# EasyEDA schematic SCH_CanSat2024_v5.1.json
TITLE: CanSat (2024) Schematic; REV: 5; Date: 2024-05-11; Sheet: 1/1; Company: Team Neptune
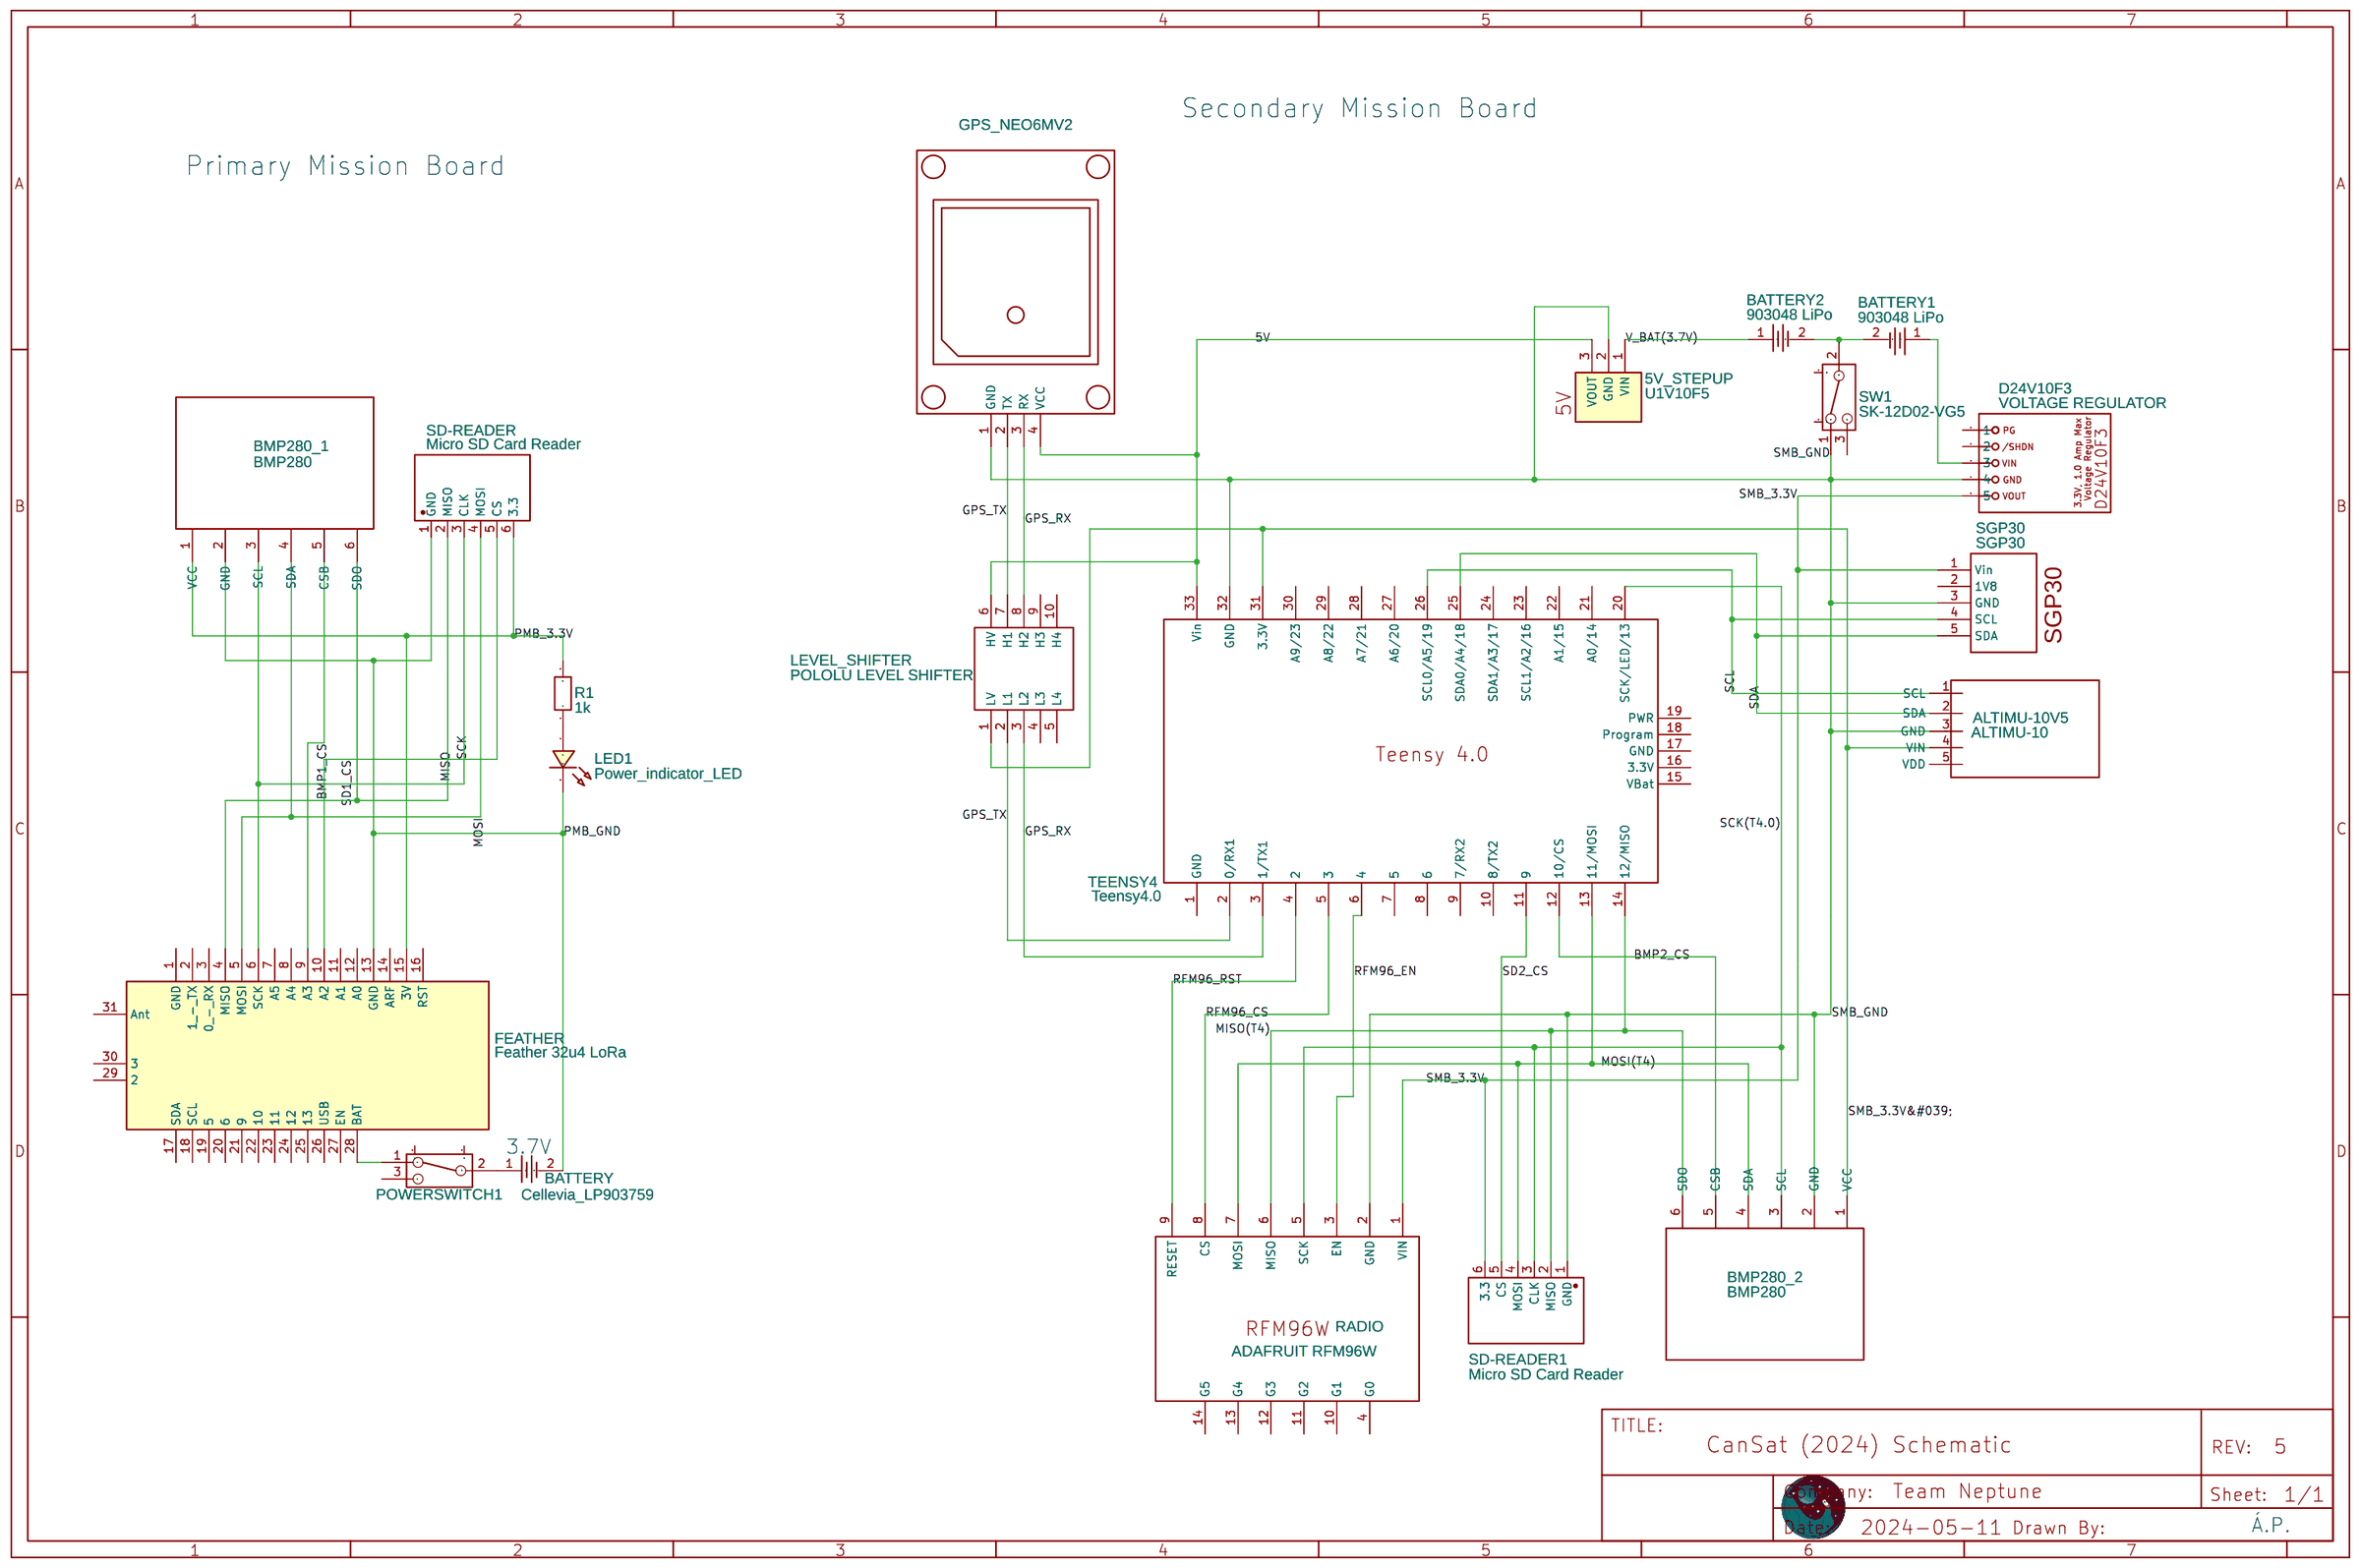
[diagram p0: schematic sheet]

## Parts
5V_STEPUP  U1V10F5  [U1V10F5]
ALTIMU-10V5  ALTIMU-10  [ALTIMU-10 V5]
BATTERY  Cellevia_LP903759  [BAT-SMD_CR1220-2]
BATTERY1  903048 LiPo  [BAT-SMD_CR1220-2]
BATTERY2  903048 LiPo  [BAT-SMD_CR1220-2]
BMP280_1  BMP280  [BMP280]
BMP280_2  BMP280  [BMP280]
D24V10F3  VOLTAGE REGULATOR  [D24V10F3 VOLTAGE REGULATOR FOOTPRINT]
FEATHER  Feather 32u4 LoRa  [FEATHER 32U4 LORA]
GPS_NEO6MV2  Cheap GPS  [GY-GPS6MV2GPSMODUL]
LED1  Power_indicator_LED  [LED0603_RED]
LEVEL_SHIFTER  POLOLU LEVEL SHIFTER  [POLOLU LEVEL SHIFTER]
POWERSWITCH1  SWITCH  [SW-TH_SK-12D02VG3]
R1  1k  [R0603]
RADIO  ADAFRUIT RFM96W  [RFMXX BOARD]
SD-READER  Micro SD Card Reader  [SD CARD READER PCB IL]
SD-READER1  Micro SD Card Reader  [SD CARD READER PCB IL]
SGP30  SGP30  [SGP30]
SW1  SK-12D02-VG5  [SW-TH_SK-12D02VG3]
TEENSY4  Teensy4.0  [TEENSY4.0]

## Library data of the parts
5V_STEPUP = U1V10F5 COPY: Contributor: winter2015; sourceId: YsmgyP7pj
ALTIMU-10V5 = ALTIMU-10: Contributor: twentysix.lolol; sourceId: 53Xf9rJ1V
BATTERY = CR1220-2: Supplier: LCSC; Manufacturer: Q&J; image: //image.lceda.cn/szlcsc/C70381.jpg; Supplier Part: C70381; Package Display: No
BATTERY1 BATTERY2 = CR1220-2: Supplier: LCSC; Manufacturer: Q&J; image: //image.lceda.cn/szlcsc/C70381.jpg; Supplier Part: C70381
BMP280_1 BMP280_2 = BMP280: Contributor: mandarkol
D24V10F3 = D24V10F5 VOLTAGE REGULATOR: Manufacturer Part: HDR-M-2.54_1x6; Contributor: mmattox4913
FEATHER = Feather 32u4 LoRa: sourceId: 1T5FDZYC8; Supplier: AdaFruit
GPS_NEO6MV2 = Cheap GPS: Contributor: rzTipping
LED1 = LED-0603_R: Manufacturer: EVERLIGHT(台湾亿光); Manufacturer Part: 19-217/R6C-AL1M2VY/3T; Supplier Part: C72044; Supplier: LCSC; Contributor: LCEDA_01
LEVEL_SHIFTER = pololu_level_shifter: Manufacturer: POLOLU; Manufacturer Part: pololu #2595; link: https://www.pololu.com/product/2595; Contributor: Adam Gajda
POWERSWITCH1 SW1 = SK-12D02-VG5: Supplier: LCSC; Supplier Part: C136722; Manufacturer: Rectangular Connectors - Contacts; Contributor: LCSC
R1 = R_0603_EU: Contributor: LCEDA_Lib
RADIO = ADAFRUIT RFM96W BOARD COPY: Manufacturer: HopeRF; Manufacturer Part: RFM96W; Supplier: Adafruit; Supplier Part: 3073; link: https://www.adafruit.com/product/3073; Contributor: joshgarde
SD-READER SD-READER1 = Micro SD Card Reader: Manufacturer Part: SD card reader 17.9x17.9; Contributor: Tinerfe; Supplier: AliExpress; Manufacturer: ShengYang; link: https://www.aliexpress.com/item/32867572635.html
SGP30 = SGP30: Manufacturer Part: Adafruit; Contributor: Lenrys29
TEENSY4 = Teensy4.0: Manufacturer: PJRC; link: https://www.pjrc.com/store/teensy40.html; Contributor: Makerkeko; Package Display: No

## Nets
5V: 5V_STEPUP.3(VOUT) GPS_NEO6MV2.4(VCC) LEVEL_SHIFTER.6(HV) TEENSY4.33(Vin)
BMP1_CS: BMP280_1.5(CSB) FEATHER.9(A3)
BMP2_CS: BMP280_2.5(CSB) TEENSY4.12(10/CS)
GPS_RX: GPS_NEO6MV2.3(RX) LEVEL_SHIFTER.3(L2) LEVEL_SHIFTER.8(H2) TEENSY4.3(1/TX1)
GPS_TX: GPS_NEO6MV2.2(TX) LEVEL_SHIFTER.2(L1) LEVEL_SHIFTER.7(H1) TEENSY4.2(0/RX1)
MISO: BMP280_1.6(SDO) FEATHER.4(MISO) SD-READER.2(MISO)
MISO(T4): BMP280_2.6(SDO) RADIO.6(MISO) SD-READER1.2(MISO) TEENSY4.14(12/MISO)
MOSI: BMP280_1.4(SDA) FEATHER.5(MOSI) SD-READER.4(MOSI)
MOSI(T4): BMP280_2.4(SDA) RADIO.7(MOSI) SD-READER1.4(MOSI) TEENSY4.13(11/MOSI)
PMB_3.3V: BMP280_1.1(VCC) FEATHER.15(3V) R1.2 SD-READER.6(3.3)
PMB_GND: BATTERY.2 BMP280_1.2(GND) FEATHER.13(GND) LED1.2 SD-READER.1(GND)
RFM96_CS: RADIO.8(CS) TEENSY4.5(3)
RFM96_EN: RADIO.3(EN) TEENSY4.6(4)
RFM96_RST: RADIO.9(RESET) TEENSY4.4(2)
SCK: BMP280_1.3(SCL) FEATHER.6(SCK) SD-READER.3(CLK)
SCK(T4.0): BMP280_2.3(SCL) RADIO.5(SCK) SD-READER1.3(CLK) TEENSY4.20(SCK/LED/13)
SCL: ALTIMU-10V5.1(SCL) SGP30.4(SCL) TEENSY4.26(SCL0/A5/19)
SD1_CS: FEATHER.10(A2) SD-READER.5(CS)
SD2_CS: SD-READER1.5(CS) TEENSY4.11(9)
SDA: ALTIMU-10V5.2(SDA) SGP30.5(SDA) TEENSY4.25(SDA0/A4/18)
SMB_3.3V: D24V10F3.5 RADIO.1(VIN) SD-READER1.6(3.3) SGP30.1(Vin)
SMB_3.3V&#039;: ALTIMU-10V5.4(VIN) BMP280_2.1(VCC) LEVEL_SHIFTER.1(LV) TEENSY4.31(3.3V)
SMB_GND: 5V_STEPUP.2(GND) ALTIMU-10V5.3(GND) BMP280_2.2(GND) D24V10F3.4 GPS_NEO6MV2.1(GND) RADIO.2(GND) SD-READER1.1(GND) SGP30.3(GND) SW1.1 TEENSY4.32(GND)
V_BAT(3.7V): 5V_STEPUP.1(VIN) BATTERY2.1
Net-(BATTERY1-1): BATTERY1.1 D24V10F3.3
Net-(BATTERY1-2): BATTERY1.2 BATTERY2.2 SW1.2
Net-(BATTERY-1): BATTERY.1 POWERSWITCH1.2
Net-(FEATHER-28): FEATHER.28(BAT) POWERSWITCH1.1
Net-(LED1-1): LED1.1 R1.1

Not connected (* = marked no-connect by the designer): ALTIMU-10V5 5(VDD); D24V10F3 1 2; FEATHER 1(GND) 2(1 - TX) 3(0 - RX) 7(A5) 8(A4) 11(A1) 12(A0) 14(ARF) 16(RST) 17(SDA) 18(SCL) 19(5) 20(6) 21(9) 22(10) 23(11) 24(12) 25(13) 26(USB) 27(EN) 29(2) 30(3) 31(Ant); LEVEL_SHIFTER 4(L3) 5(L4) 9(H3) 10(H4); POWERSWITCH1 3 4 5; RADIO 4(G0) 10(G1) 11(G2) 12(G3) 13(G4) 14(G5); SGP30 2(1V8); SW1 3 4 5; TEENSY4 1(GND) 7(5) 8(6) 9(7/RX2) 10(8/TX2) 15(VBat) 16(3.3V) 17(GND) 18(Program) 19(PWR) 21(A0/14) 22(A1/15) 23(SCL1/A2/16) 24(SDA1/A3/17) 27(A6/20) 28(A7/21) 29(A8/22) 30(A9/23)

## Notes on the sheet
- Secondary Mission Board
- Primary Mission Board
- 3.7V
- Á.P.
